# Altium schematic sheet Sheet1.SchDoc
size 689 x 565 mm
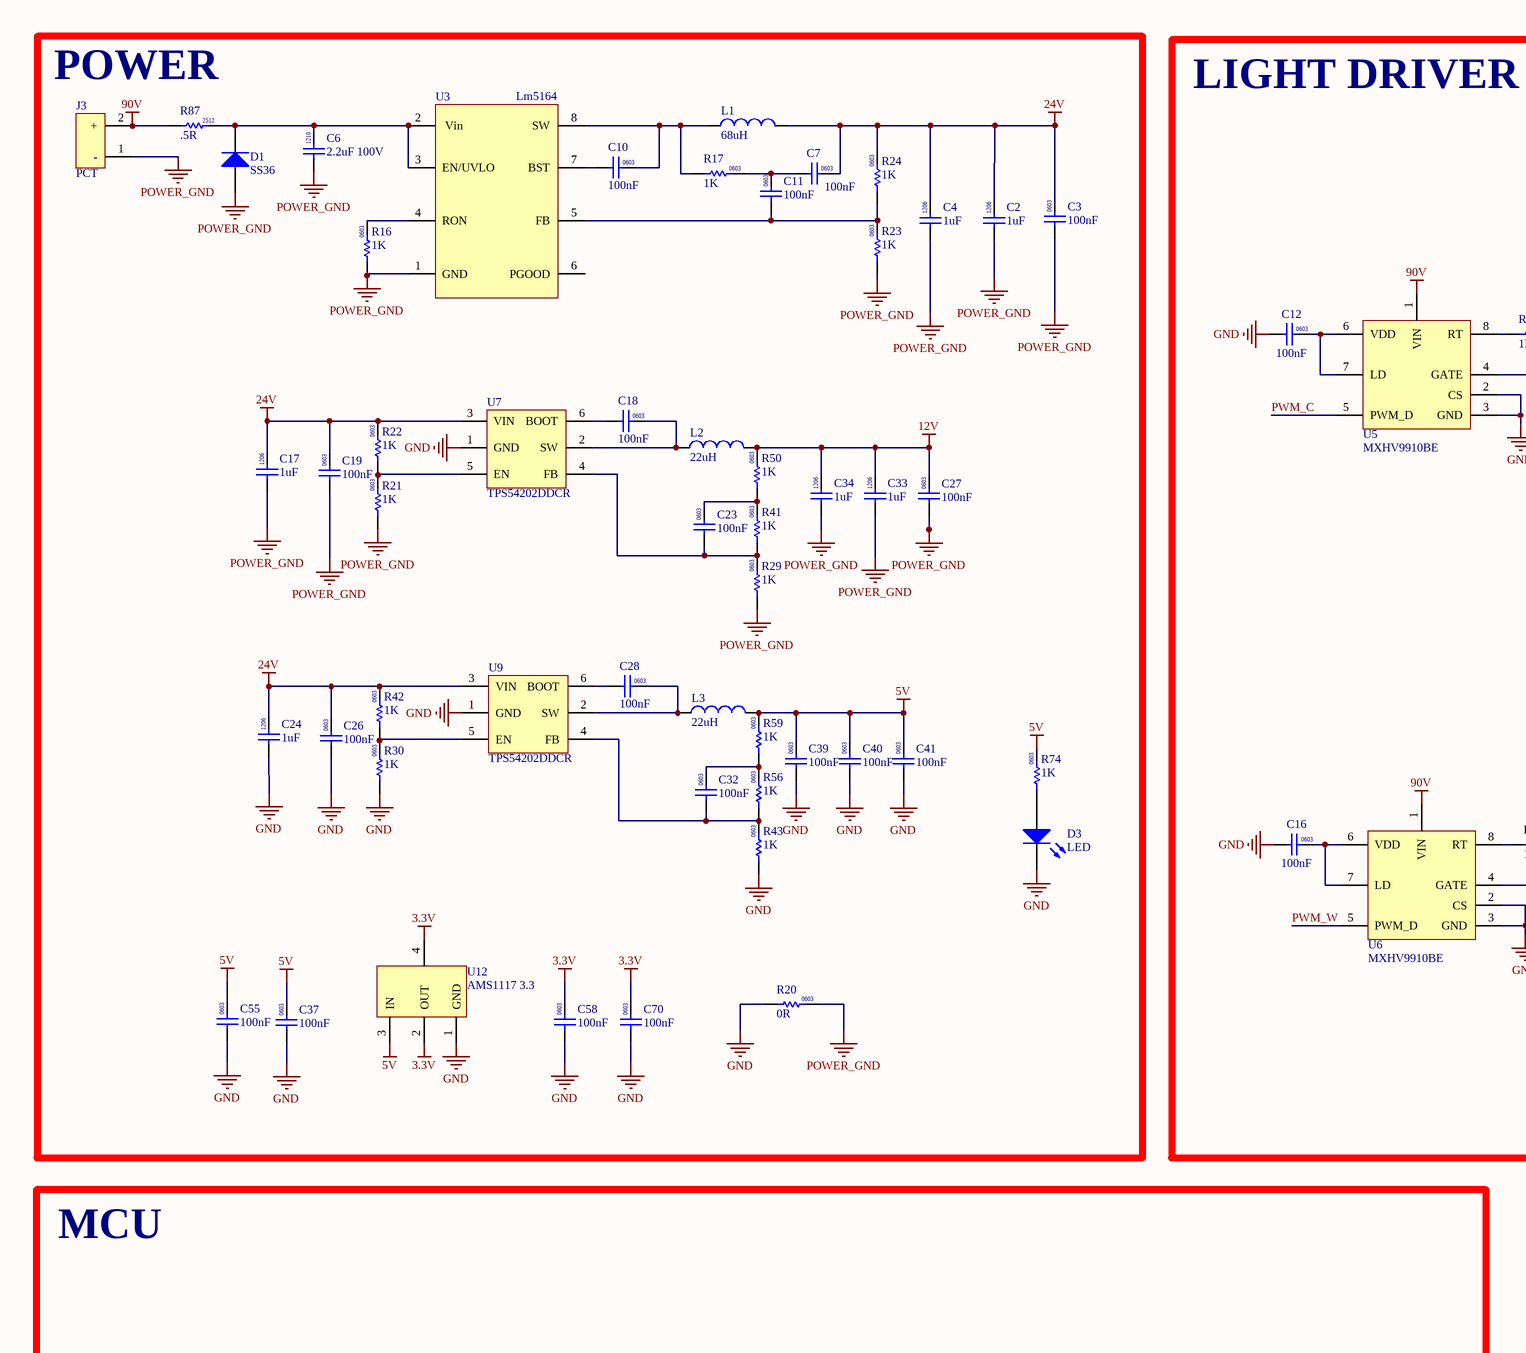
[diagram p0: Sheet1.SchDoc, top left]
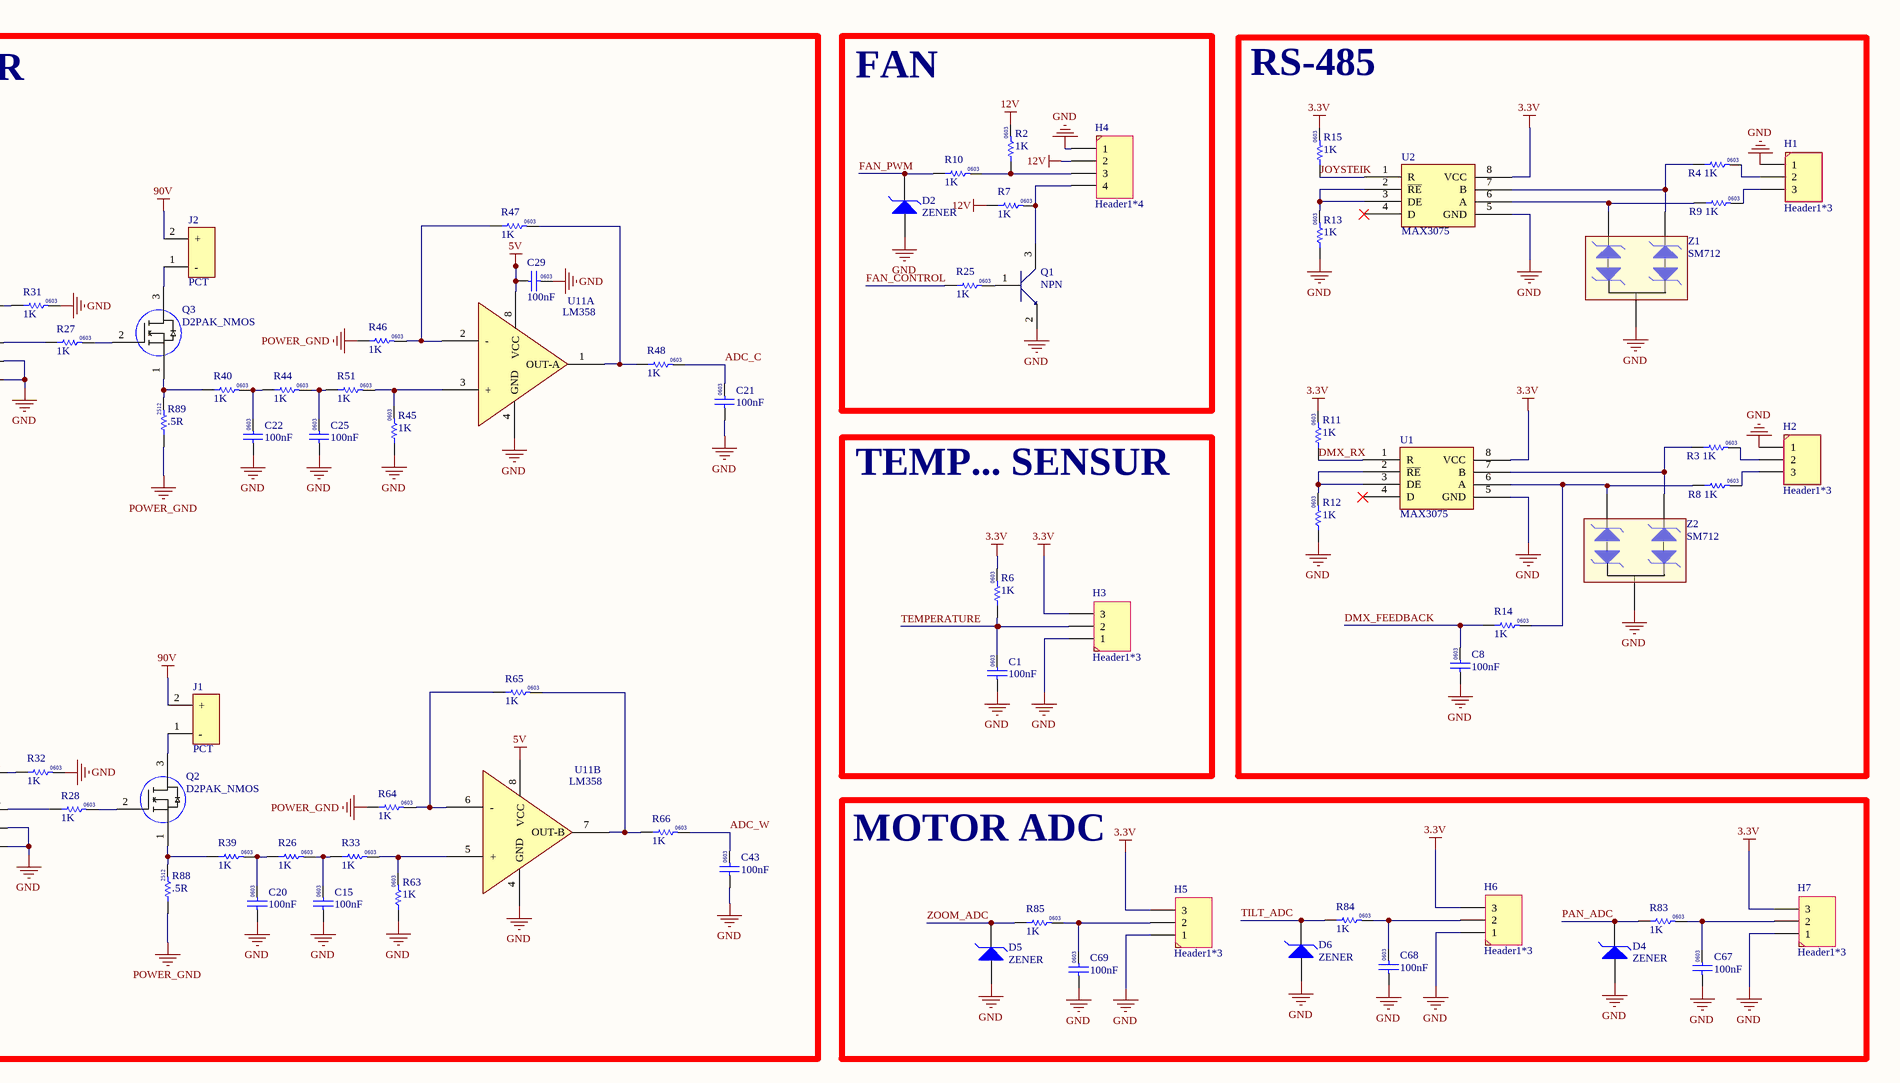
[diagram p1: Sheet1.SchDoc, top right]
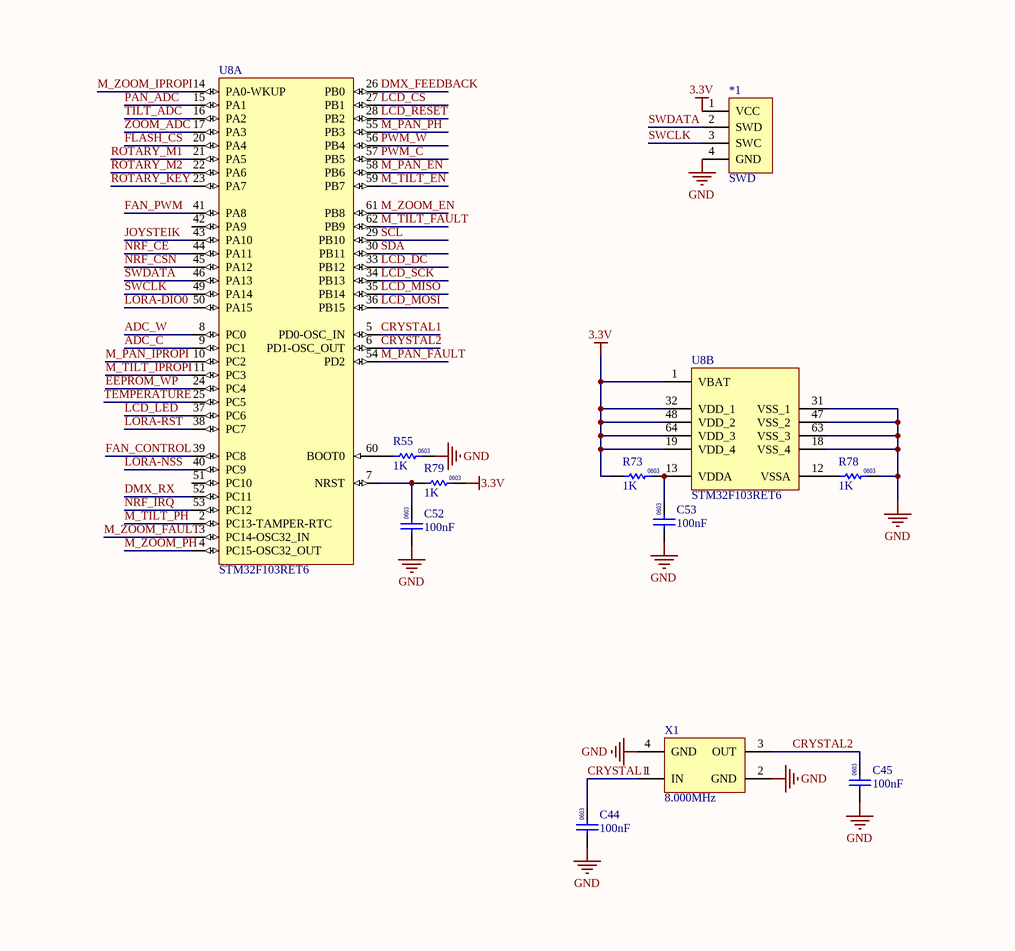
[diagram p2: Sheet1.SchDoc, bottom left]
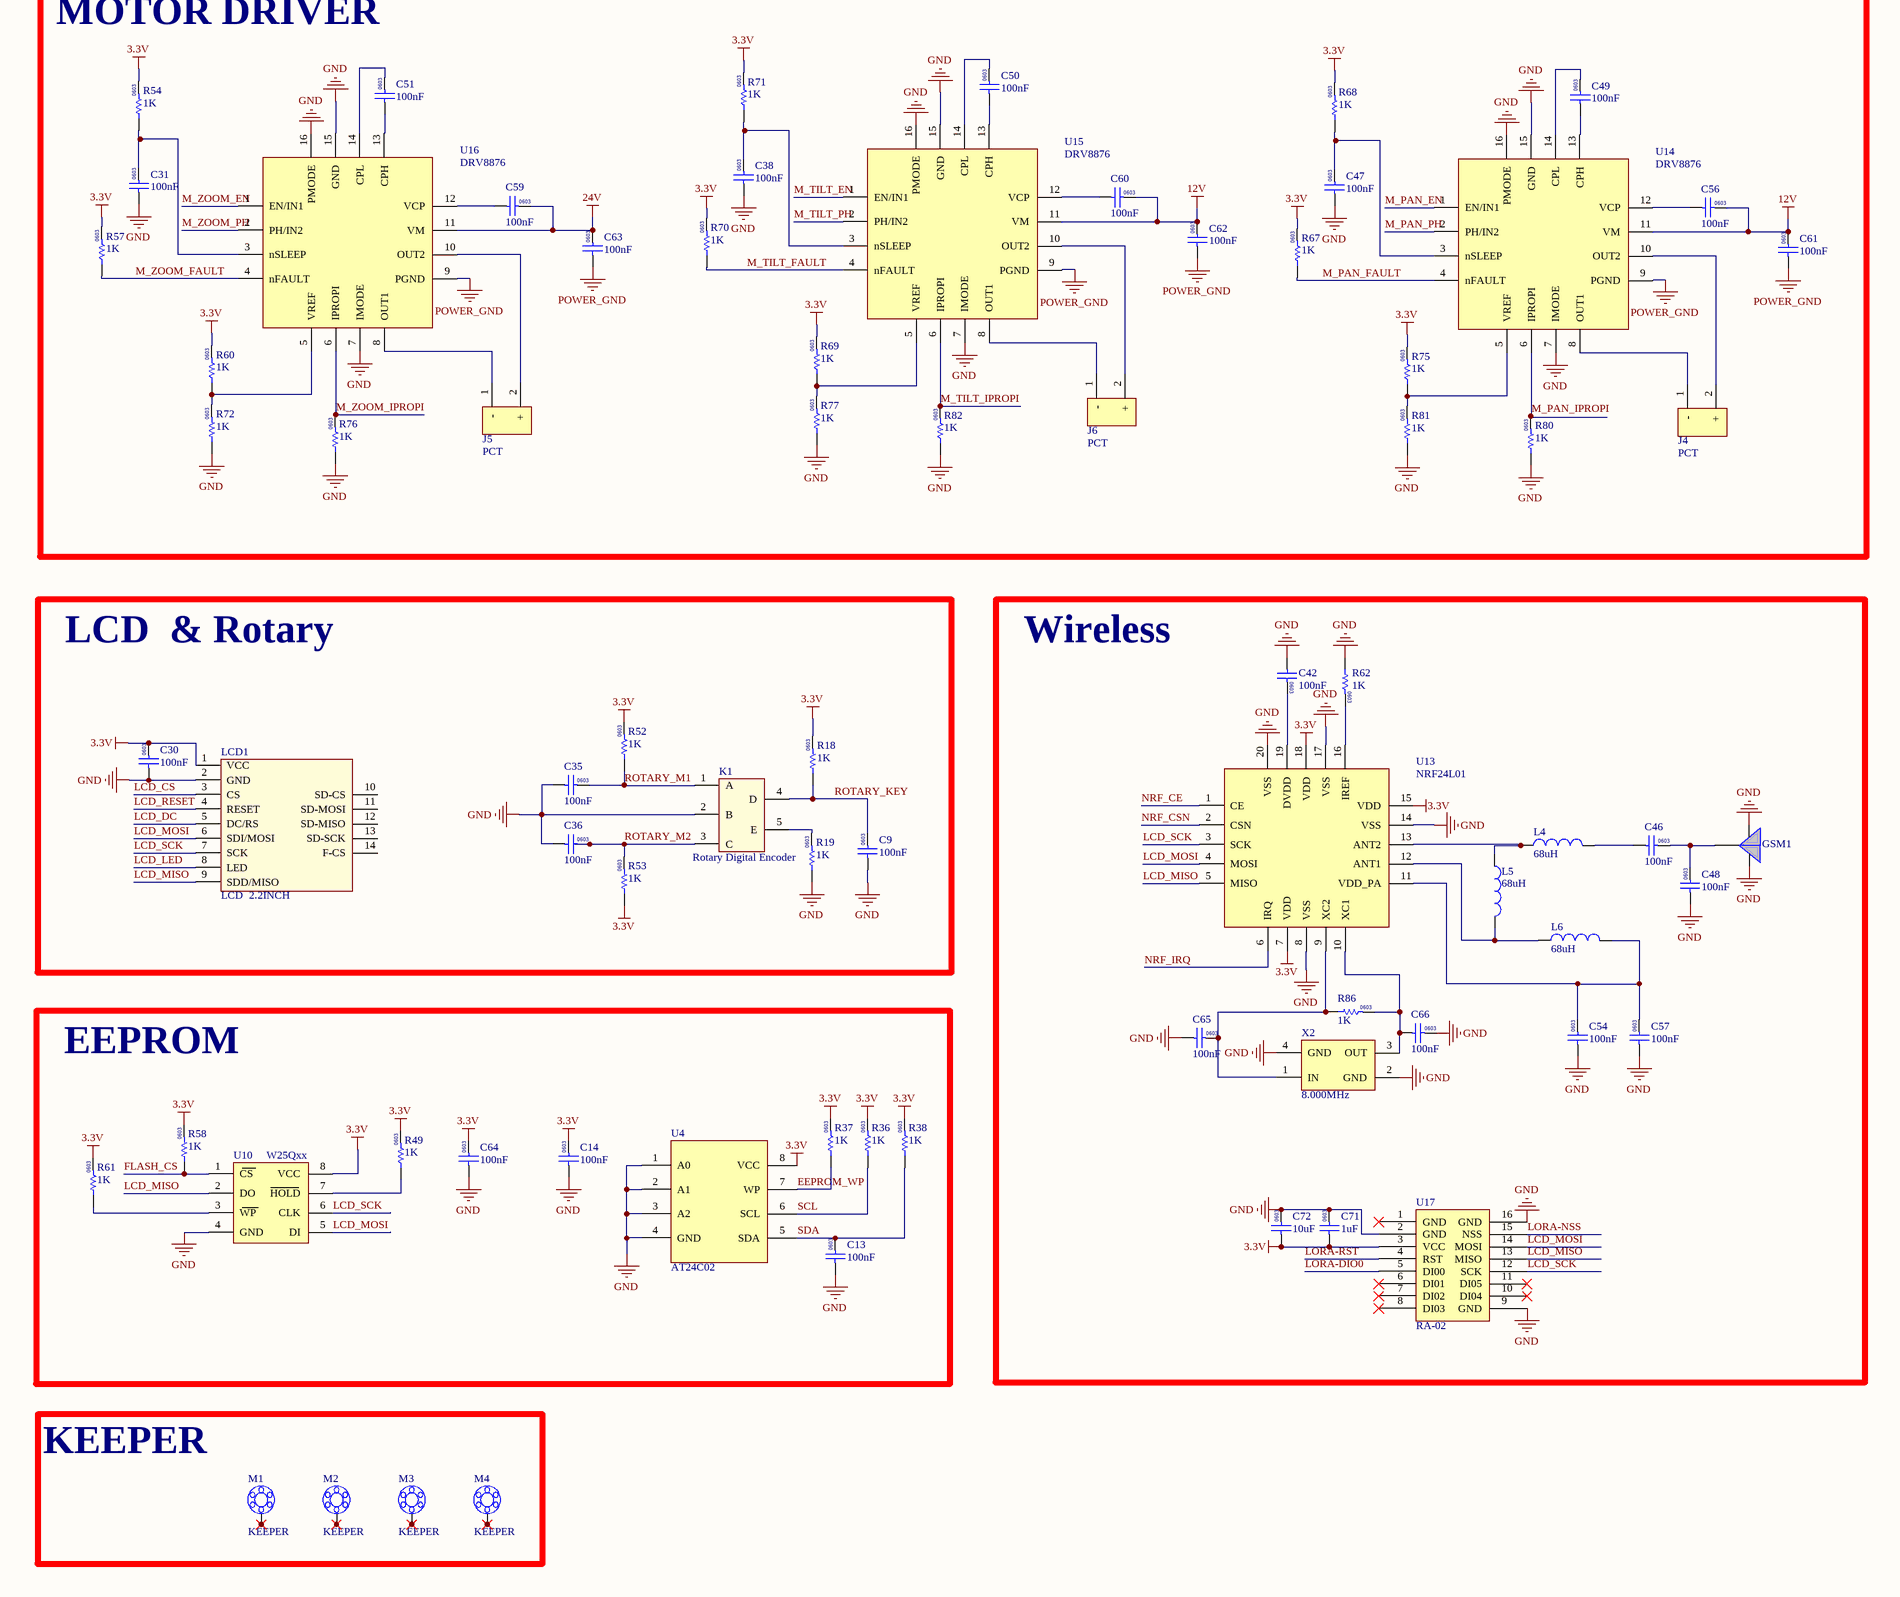
[diagram p3: Sheet1.SchDoc, bottom right]

## Parts
*1  SWD  [SWD]
C1  100nF  [CAP0603]
C2  1uF  [CAP1206]
C3  100nF  [CAP0603]
C4  1uF  [CAP1206]
C6  2.2uF 100V  [CAP 1210]
C7  100nF  [CAP0603]
C8  100nF  [CAP0603]
C9  100nF  [CAP0603]
C10  100nF  [CAP0603]
C11  100nF  [CAP0603]
C12  100nF  [CAP0603]
C13  100nF  [CAP0603]
C14  100nF  [CAP0603]
C15  100nF  [CAP0603]
C16  100nF  [CAP0603]
C17  1uF  [CAP1206]
C18  100nF  [CAP0603]
C19  100nF  [CAP0603]
C20  100nF  [CAP0603]
C21  100nF  [CAP0603]
C22  100nF  [CAP0603]
C23  100nF  [CAP0603]
C24  1uF  [CAP1206]
C25  100nF  [CAP0603]
C26  100nF  [CAP0603]
C27  100nF  [CAP0603]
C28  100nF  [CAP0603]
C29  100nF  [CAP0603]
C30  100nF  [CAP0603]
C31  100nF  [CAP0603]
C32  100nF  [CAP0603]
C33  1uF  [CAP1206]
C34  1uF  [CAP1206]
C35  100nF  [CAP0603]
C36  100nF  [CAP0603]
C37  100nF  [CAP0603]
C38  100nF  [CAP0603]
C39  100nF  [CAP0603]
C40  100nF  [CAP0603]
C41  100nF  [CAP0603]
C42  100nF  [CAP0603]
C43  100nF  [CAP0603]
C44  100nF  [CAP0603]
C45  100nF  [CAP0603]
C46  100nF  [CAP0603]
C47  100nF  [CAP0603]
C48  100nF  [CAP0603]
C49  100nF  [CAP0603]
C50  100nF  [CAP0603]
C51  100nF  [CAP0603]
C52  100nF  [CAP0603]
C53  100nF  [CAP0603]
C54  100nF  [CAP0603]
C55  100nF  [CAP0603]
C56  100nF  [CAP0603]
C57  100nF  [CAP0603]
C58  100nF  [CAP0603]
C59  100nF  [CAP0603]
C60  100nF  [CAP0603]
C61  100nF  [CAP0603]
C62  100nF  [CAP0603]
C63  100nF  [CAP0603]
C64  100nF  [CAP0603]
C65  100nF  [CAP0603]
C66  100nF  [CAP0603]
C67  100nF  [CAP0603]
C68  100nF  [CAP0603]
C69  100nF  [CAP0603]
C70  100nF  [CAP0603]
C71  1uF  [CAP0603]
C72  10uF  [CAP0603]
D1  SS36  [SS36]
D2  ZENER  [ZENER]
D3  LED  [LED0805]
D4  ZENER  [ZENER]
D5  ZENER  [ZENER]
D6  ZENER  [ZENER]
GSM1  Antenna  [IPX Connector]  (value not drawn)
H1  Header1*3  [HEADER1*3]
H2  Header1*3  [HEADER1*3]
H3  Header1*3  [HEADER1*3]
H4  Header1*4  [HEADER1*4]
H5  Header1*3  [HEADER1*3]
H6  Header1*3  [HEADER1*3]
H7  Header1*3  [HEADER1*3]
J1  PCT  [Power Connector Straght]
J2  PCT  [Power Connector Straght]
J3  PCT  [Power Connector Straght]
J4  PCT  [Power Connector Straght]
J5  PCT  [Power Connector Straght]
J6  PCT  [Power Connector Straght]
K1  Rotary Digital Encoder  [Rotary Digital Encoder]
L1  68uH  [INDUCTOR  10*10]
L2  22uH  [INDUCTOR 7*7]
L3  22uH  [INDUCTOR 7*7]
L4  68uH  [RES0603]
L5  68uH  [RES0603]
L6  68uH  [RES0603]
LCD1  LCD  2.2INCH  [TFT LCD 2.2inch  QVGA]
M1  KEEPER  [MOUNTING]
M2  KEEPER  [MOUNTING]
M3  KEEPER  [MOUNTING]
M4  KEEPER  [MOUNTING]
Q1  NPN  [BC817]
Q2  D2PAK_NMOS  [D2PAK_NMOS]
Q3  D2PAK_NMOS  [D2PAK_NMOS]
R2  1K  [RES0603]
R3  1K  [RES0603]
R4  1K  [RES0603]
R6  1K  [RES0603]
R7  1K  [RES0603]
R8  1K  [RES0603]
R9  1K  [RES0603]
R10  1K  [RES0603]
R11  1K  [RES0603]
R12  1K  [RES0603]
R13  1K  [RES0603]
R14  1K  [RES0603]
R15  1K  [RES0603]
R16  1K  [RES0603]
R17  1K  [RES0603]
R18  1K  [RES0603]
R19  1K  [RES0603]
R20  0R  [RES0603]
R21  1K  [RES0603]
R22  1K  [RES0603]
R23  1K  [RES0603]
R24  1K  [RES0603]
R25  1K  [RES0603]
R26  1K  [RES0603]
R27  1K  [RES0603]
R28  1K  [RES0603]
R29  1K  [RES0603]
R30  1K  [RES0603]
R31  1K  [RES0603]
R32  1K  [RES0603]
R33  1K  [RES0603]
R36  1K  [RES0603]
R37  1K  [RES0603]
R38  1K  [RES0603]
R39  1K  [RES0603]
R40  1K  [RES0603]
R41  1K  [RES0603]
R42  1K  [RES0603]
R43  1K  [RES0603]
R44  1K  [RES0603]
R45  1K  [RES0603]
R46  1K  [RES0603]
R47  1K  [RES0603]
R48  1K  [RES0603]
R49  1K  [RES0603]
R50  1K  [RES0603]
R51  1K  [RES0603]
R52  1K  [RES0603]
R53  1K  [RES0603]
R54  1K  [RES0603]
R55  1K  [RES0603]
R56  1K  [RES0603]
R57  1K  [RES0603]
R58  1K  [RES0603]
R59  1K  [RES0603]
R60  1K  [RES0603]
R61  1K  [RES0603]
R62  1K  [RES0603]
R63  1K  [RES0603]
R64  1K  [RES0603]
R65  1K  [RES0603]
R66  1K  [RES0603]
R67  1K  [RES0603]
R68  1K  [RES0603]
R69  1K  [RES0603]
R70  1K  [RES0603]
R71  1K  [RES0603]
R72  1K  [RES0603]
R73  1K  [RES0603]
R74  1K  [RES0603]
R75  1K  [RES0603]
R76  1K  [RES0603]
R77  1K  [RES0603]
R78  1K  [RES0603]
R79  1K  [RES0603]
R80  1K  [RES0603]
R81  1K  [RES0603]
R82  1K  [RES0603]
R83  1K  [RES0603]
R84  1K  [RES0603]
R85  1K  [RES0603]
R86  1K  [RES0603]
R87  .5R  [RES2512]
R88  .5R  [RES2512]
R89  .5R  [RES2512]
U1  MAX3075  [MAX3075]
U2  MAX3075  [MAX3075]
U3  Lm5164  [Lm5164]
U4  AT24C02  [AT24C02]
U5  MXHV9910BE  [MXHV9910BE]
U6  MXHV9910BE  [MXHV9910BE]
U7  TPS54202DDCR  [TPS54202DDCR]
U8  STM32F103RET6  [STM32F103RET6]  (parts A,B of 2)
U9  TPS54202DDCR  [TPS54202DDCR]
U10  W25Qxx  [W25QXX]
U11  LM358  [LM358]  (parts A,B of 2)
U12  AMS1117 3.3  [AMS1117]
U13  NRF24L01  [NRF24L01]
U14  DRV8876  [Drv8876]
U15  DRV8876  [Drv8876]
U16  DRV8876  [Drv8876]
U17  RA-02  [LORA]
X1  8.000MHz  [CRYSTAL_SMD4PIN]
X2  8.000MHz  [CRYSTAL - SMD4PIN 1.6*2]
Z1  SM712  [BC817]
Z2  SM712  [BC817]

## Blocks framed on the sheet
POWER: C2-C4 C6 C7 C10 C11 C17-C19 C23 C24 C26-C28 C32-C34 C37 C39-C41 C55 C58 C70 D1 D3 J3 L1-L3 R16 R17 R20-R24 R29 R30 R41-R43 R50 R56 R59 R74 R87 U3 U7 U9 U12
LIGHT DRIVER: C12 C15 C16 C20-C22 C25 C29 C43 J1 J2 Q2 Q3 R26-R28 R31-R33 R39 R40 R44-R48 R51 R63-R66 R88 R89 U5 U6 U11
FAN: D2 H4 Q1 R2 R7 R10 R25
RS-485: C8 H1 H2 R3 R4 R8 R9 R11-R15 U1 U2 Z1 Z2
TEMP... SENSUR: C1 H3 R6
MOTOR ADC: C67-C69 D4-D6 H5-H7 R83-R85
MCU: *1 C44 C45 C52 C53 R55 R73 R78 R79 U8 X1
MOTOR DRIVER: C31 C38 C47 C49-C51 C56 C59-C63 J4-J6 R54 R57 R60 R67-R72 R75-R77 R80-R82 U14-U16
LCD  & Rotary: C9 C30 C35 C36 K1 LCD1 R18 R19 R52 R53
Wireless: C42 C46 C48 C54 C57 C65 C66 C71 C72 GSM1 L4-L6 R62 R86 U13 U17 X2
EEPROM: C13 C14 C64 R36-R38 R49 R58 R61 U4 U10
KEEPER: M1-M4

## Nets
3.3V: *1.1(VCC) C14.2 C30.2 C58.2 C64.2 C70.2 C71.1 C72.1 H3.3 H5.3 H6.3 H7.3 LCD1.1(VCC) R6.2 R11.2 R15.2 R18.2 R36.2 R37.2 R38.2 R49.2 R52.2 R53.1 R54.2 R57.2 R58.2 R60.2 R61.2 R67.2 R68.2 R69.2 R70.2 R71.2 R73.1 R75.2 R79.2 U1.8(VCC) U2.8(VCC) U4.8(VCC) U8.1(VBAT) U8.19(VDD_4) U8.32(VDD_1) U8.48(VDD_2) U8.64(VDD_3) U10.8(VCC) U12.2(OUT) U12.4 U13.7(VDD) U13.15(VDD) U13.18(VDD) U17.3(VCC)
5V: C29.1 C37.2 C39.2 C40.2 C41.2 C55.2 L3.2 R59.2 R74.2 U11.8(VCC) U12.3(IN)
12V: C27.2 C33.2 C34.2 C56.2 C60.2 C61.2 C62.2 H4.2 L2.2 R2.2 R7.1 R50.2 U14.11(VM) U15.11(VM)
24V: C2.2 C3.2 C4.2 C7.2 C17.2 C19.2 C24.2 C26.2 C59.2 C63.2 L1.2 R22.2 R24.2 R42.2 U7.3(VIN) U9.3(VIN) U16.11(VM)
90V: J1.2(+) J2.2(+) J3.2(+) R87.1 U5.1(VIN) U6.1(VIN)
GND: *1.4(GND) C1.1 C8.1 C9.1 C12.1 C13.1 C14.1 C15.1 C16.1 C20.1 C21.1 C22.1 C24.1 C25.1 C26.1 C29.2 C30.1 C31.1 C35.1 C36.1 C37.1 C38.1 C39.1 C40.1 C41.1 C42.1 C43.1 C44.1 C45.1 C47.1 C48.1 C52.1 C53.1 C54.1 C55.1 C57.1 C58.1 C64.1 C65.1 C66.2 C67.1 C68.1 C69.1 C70.1 C71.2 C72.2 D2.1(A) D3.2(K) D4.1(A) D5.1(A) D6.1(A) GSM1.1 GSM1.2 H1.1 H2.1 H3.1 H4.1 H5.1 H6.1 H7.1 K1.2(B) LCD1.2(GND) Q1.2(E) R12.1 R13.1 R19.1 R20.1 R30.1 R31.2 R32.2 R43.1 R45.1 R55.2 R62.1 R63.1 R72.1 R76.1 R77.1 R78.2 R80.1 R81.1 R82.1 U1.5(GND) U2.5(GND) U4.1(A0) U4.2(A1) U4.3(A2) U4.4(GND) U5.2(CS) U5.3(GND) U6.2(CS) U6.3(GND) U7.1(GND) U8.18(VSS_4) U8.31(VSS_1) U8.47(VSS_2) U8.63(VSS_3) U9.1(GND) U10.4(GND) U11.4(GND) U12.1(GND) U13.8(VSS) U13.14(VSS) U13.17(VSS) U13.20(VSS) U14.7(IMODE) U14.15(GND) U14.16(PMODE) U15.7(IMODE) U15.15(GND) U15.16(PMODE) U16.7(IMODE) U16.15(GND) U16.16(PMODE) U17.2(GND) U17.9(GND) U17.16(GND) X1.2(GND) X1.4(GND) X2.2(GND) X2.4(GND) Z1.3(K) Z2.3(K)
POWER_GND: C2.1 C3.1 C4.1 C6.1 C17.1 C19.1 C27.1 C33.1 C34.1 C61.1 C62.1 C63.1 D1.1(A) J3.1(-) R16.1 R20.2 R21.1 R23.1 R29.1 R46.1 R64.1 R88.1 R89.1 U3.1(GND) U14.9(PGND) U15.9(PGND) U16.9(PGND)
ADC_C: C21.2 R48.2 U8.9(PC1)
ADC_W: C43.2 R66.2 U8.8(PC0)
CRYSTAL1: C44.2 U8.5(PD0-OSC_IN) X1.1(IN)
CRYSTAL2: C45.2 U8.6(PD1-OSC_OUT) X1.3(OUT)
DMX_FEEDBACK: C8.2 R14.1 U8.26(PB0)
DMX_RX: R11.1 U1.1(R) U8.52(PC11)
EEPROM_WP: R37.1 U4.7(WP) U8.24(PC4)
FAN_CONTROL: R25.1 U8.39(PC8)
FAN_PWM: D2.2(K) R10.1 U8.41(PA8)
FLASH_CS: R58.1 U8.20(PA4) U10.1(CS)
JOYSTEIK: R15.1 U2.1(R) U8.43(PA10)
LCD_CS: LCD1.3(CS) U8.27(PB1)
LCD_DC: LCD1.5(DC/RS) U8.33(PB12)
LCD_LED: LCD1.8(LED) U8.37(PC6)
LCD_MISO: LCD1.9(SDD/MISO) U8.35(PB14) U10.2(DO) U13.5(MISO) U17.13(MISO)
LCD_MOSI: LCD1.6(SDI/MOSI) U8.36(PB15) U10.5(DI) U13.4(MOSI) U17.14(MOSI)
LCD_RESET: LCD1.4(RESET) U8.28(PB2)
LCD_SCK: LCD1.7(SCK) U8.34(PB13) U10.6(CLK) U13.3(SCK) U17.12(SCK)
LORA-DIO0: U8.50(PA15) U17.5(DI00)
LORA-NSS: U8.40(PC9) U17.15(NSS)
LORA-RST: U8.38(PC7) U17.4(RST)
M_PAN_EN: U8.58(PB6) U14.1(EN/IN1)
M_PAN_FAULT: R67.1 U8.54(PD2) U14.4(nFAULT)
M_PAN_IPROPI: R80.2 U8.10(PC2) U14.6(IPROPI)
M_PAN_PH: U8.55(PB3) U14.2(PH/IN2)
M_TILT_EN: U8.59(PB7) U15.1(EN/IN1)
M_TILT_FAULT: R70.1 U8.62(PB9) U15.4(nFAULT)
M_TILT_IPROPI: R82.2 U8.11(PC3) U15.6(IPROPI)
M_TILT_PH: U8.2(PC13-TAMPER-RTC) U15.2(PH/IN2)
M_ZOOM_EN: U8.61(PB8) U16.1(EN/IN1)
M_ZOOM_FAULT: R57.1 U8.3(PC14-OSC32_IN) U16.4(nFAULT)
M_ZOOM_IPROPI: R76.2 U8.14(PA0-WKUP) U16.6(IPROPI)
M_ZOOM_PH: U8.4(PC15-OSC32_OUT) U16.2(PH/IN2)
NRF_CE: U8.44(PA11) U13.1(CE)
NRF_CSN: U8.45(PA12) U13.2(CSN)
NRF_IRQ: U8.53(PC12) U13.6(IRQ)
PAN_ADC: D4.2(K) R83.1 U8.15(PA1)
PWM_C: U5.5(PWM_D) U8.57(PB5)
PWM_W: U6.5(PWM_D) U8.56(PB4)
ROTARY_KEY: C9.2 K1.4(D) R18.1 U8.23(PA7)
ROTARY_M1: C35.2 K1.1(A) R52.1 U8.21(PA5)
ROTARY_M2: C36.2 K1.3(C) R53.2 U8.22(PA6)
SCL: R36.1 U4.6(SCL) U8.29(PB10)
SDA: C13.2 R38.1 U4.5(SDA) U8.30(PB11)
SWCLK: *1.3(SWC) U8.49(PA14)
SWDATA: *1.2(SWD) U8.46(PA13)
TEMPERATURE: C1.2 H3.2 R6.1 U8.25(PC5)
TILT_ADC: D6.2(K) R84.1 U8.16(PA2)
ZOOM_ADC: D5.2(K) R85.1 U8.17(PA3)
NetC6_2: C6.2 D1.2(K) R87.2 U3.2(Vin) U3.3(EN/UVLO)
NetC7_1: C7.1 C11.2 R17.2
NetC10_1: C10.1 U3.7(BST)
NetC10_2: C10.2 L1.1 R17.1 U3.8(SW)
NetC11_1: C11.1 R23.2 R24.1 U3.5(FB)
NetC12_2: C12.2 U5.6(VDD) U5.7(LD)
NetC15_2: C15.2 R26.2 R33.1
NetC16_2: C16.2 U6.6(VDD) U6.7(LD)
NetC18_1: C18.1 U7.6(BOOT)
NetC18_2: C18.2 L2.1 U7.2(SW)
NetC20_2: C20.2 R26.1 R39.2
NetC22_2: C22.2 R40.2 R44.1
NetC23_1: C23.1 R29.2 R41.1 U7.4(FB)
NetC23_2: C23.2 R41.2 R50.1
NetC25_2: C25.2 R44.2 R51.1
NetC28_1: C28.1 U9.6(BOOT)
NetC28_2: C28.2 L3.1 U9.2(SW)
NetC31_2: C31.2 R54.1 U16.3(nSLEEP)
NetC32_1: C32.1 R43.2 R56.1 U9.4(FB)
NetC32_2: C32.2 R56.2 R59.1
NetC38_2: C38.2 R71.1 U15.3(nSLEEP)
NetC42_2: C42.2 U13.19(DVDD)
NetC46_1: C46.1 L4.2
NetC46_2: C46.2 C48.2 GSM1.3
NetC47_2: C47.2 R68.1 U14.3(nSLEEP)
NetC49_1: C49.1 U14.13(CPH)
NetC49_2: C49.2 U14.14(CPL)
NetC50_1: C50.1 U15.13(CPH)
NetC50_2: C50.2 U15.14(CPL)
NetC51_1: C51.1 U16.13(CPH)
NetC51_2: C51.2 U16.14(CPL)
NetC52_2: C52.2 R79.1 U8.7(NRST)
NetC53_2: C53.2 R73.2 U8.13(VDDA)
NetC54_2: C54.2 C57.2 L6.2 U13.11(VDD_PA)
NetC56_1: C56.1 U14.12(VCP)
NetC59_1: C59.1 U16.12(VCP)
NetC60_1: C60.1 U15.12(VCP)
NetC65_2: C65.2 R86.1 U13.9(XC2) X2.1(IN)
NetC66_1: C66.1 R86.2 U13.10(XC1) X2.3(OUT)
NetC67_2: C67.2 H7.2 R83.2
NetC68_2: C68.2 H6.2 R84.2
NetC69_2: C69.2 H5.2 R85.2
NetD3_1: D3.1(A) R74.1
NetH1_2: H1.2 R4.2
NetH1_3: H1.3 R9.2
NetH2_2: H2.2 R3.2
NetH2_3: H2.3 R8.2
NetH4_3: H4.3 R2.1 R10.2
NetH4_4: H4.4 Q1.3(C) R7.2
NetJ1_1: J1.1(-) Q2.3(D)
NetJ2_1: J2.1(-) Q3.3(D)
NetJ4_1: J4.1(-) U14.8(OUT1)
NetJ4_2: J4.2(+) U14.10(OUT2)
NetJ5_1: J5.1(-) U16.8(OUT1)
NetJ5_2: J5.2(+) U16.10(OUT2)
NetJ6_1: J6.1(-) U15.8(OUT1)
NetJ6_2: J6.2(+) U15.10(OUT2)
NetK1_5: K1.5(E) R19.2
NetL4_1: L4.1 L5.1 U13.13(ANT2)
NetL5_2: L5.2 L6.1 U13.12(ANT1)
NetM1_1: M1.1 M1.2 M1.3 M1.4 M1.5 M1.6 M1.7
NetM2_1: M2.1 M2.2 M2.3 M2.4 M2.5 M2.6 M2.7
NetM3_1: M3.1 M3.2 M3.3 M3.4 M3.5 M3.6 M3.7
NetM4_1: M4.1 M4.2 M4.3 M4.4 M4.5 M4.6 M4.7
NetQ1_1: Q1.1(B) R25.2
NetQ2_1: Q2.1 R39.1 R88.2
NetQ2_2: Q2.2 R28.2
NetQ3_1: Q3.1 R40.1 R89.2
NetQ3_2: Q3.2 R27.2
NetR3_1: R3.1 U1.7(B) Z2.2(K)
NetR4_1: R4.1 U2.7(B) Z1.2(K)
NetR8_1: R8.1 R14.2 U1.6(A) Z2.1(K)
NetR9_1: R9.1 U2.6(A) Z1.1(K)
NetR12_2: R12.2 U1.2(~{RE}) U1.3(DE)
NetR13_2: R13.2 U2.2(~{RE}) U2.3(DE)
NetR16_2: R16.2 U3.4(RON)
NetR21_2: R21.2 R22.1 U7.5(EN)
NetR27_1: R27.1 U5.4(GATE)
NetR28_1: R28.1 U6.4(GATE)
NetR30_2: R30.2 R42.1 U9.5(EN)
NetR31_1: R31.1 U5.8(RT)
NetR32_1: R32.1 U6.8(RT)
NetR33_2: R33.2 R63.2 U11.5(+)
NetR45_2: R45.2 R51.2 U11.3(+)
NetR46_2: R46.2 R47.1 U11.2(-)
NetR47_2: R47.2 R48.1 U11.1(OUT-A)
NetR49_1: R49.1 U10.7(HOLD)
NetR55_1: R55.1 U8.60(BOOT0)
NetR60_1: R60.1 R72.2 U16.5(VREF)
NetR61_1: R61.1 U10.3(WP)
NetR62_2: R62.2 U13.16(IREF)
NetR64_2: R64.2 R65.1 U11.6(-)
NetR65_2: R65.2 R66.1 U11.7(OUT-B)
NetR69_1: R69.1 R77.2 U15.5(VREF)
NetR75_1: R75.1 R81.2 U14.5(VREF)
NetR78_1: R78.1 U8.12(VSSA)

Not connected (* = marked no-connect by the designer): LCD1 10(SD-CS) 11(SD-MOSI) 12(SD-MISO) 13(SD-SCK) 14(F-CS); U1 4(D)*; U2 4(D)*; U3 6(PGOOD); U8 42(PA9) 51(PC10); U17 1(GND)* 6(DI01)* 7(DI02)* 8(DI03)* 10(DI04)* 11(DI05)*

## Notes on the sheet
- (in symbol CAP0603) 0603
- (in symbol CAP1206) 1206
- (in symbol CAP1210) 1210
- (in symbol RES0603) 0603
- (in symbol RES2512) 2512

## Library data of the parts
C1 C3 C7-C16 C18-C23 C25-C32 C35-C72 = CAP0603
C2 C4 C17 C24 C33 C34 = CAP1206
C6 = CAP1210
D3 = LED0805
H1-H3 H5-H7 = Header1*3: Header, 3-Pin; LatestRevisionDate: 17-Jul-2002; LatestRevisionNote: Re-released for DXP Platform.; Publisher: Altium Limited
H4 = Header1*4: Header, 4-Pin
J1-J6 = Power Connector Straght
L1 L4-L6 = INDUCTOR  10*10
L2 L3 = INDUCTOR 7*7
LCD1 = TFT LCD 2.2inch  QVGA
M1-M4 = MOUNTING
Q1 = BC817
R2-R4 R6-R33 R36-R86 = RES0603
R87-R89 = RES2512
U8 = STM32F103RET6: ARM Cortex-M3 32-bit MCU, 512 KB Flash, 64 KB Internal RAM, 51 I/Os, 64-pin LQFP, -40 to 85 degC, Tray; A/D Converter: 3x12-bit (16 Channel); D/A Converter: 2x12-bit (2 Channel); FLASH Size (Prog) (kB): 512; I/Os (High Current): 51; Internal RAM Size (kB): 64; Operating Frequency(F) (Processor speed) (MHz): 72; Supply Voltage(Vcc) min (V): 2; DatasheetVersion: Rev. 8; PackageVersion: Rev. 4, 06/2013; PackageReference: LQFP64; PackageDescription: 64-Pin Low Profile Quad Flat Package, 10 x 10 mm Body, 0.5 mm Pitch; Supplier 1: Digi-Key; Supplier Part Number 1: 497-6444-ND; Supplier 2: Farnell; Supplier Part Number 2: 1624138; Supplier 3: Newark; Supplier Part Number 3: 01P4101; Supplier 4: Newark; Supplier Part Number 4: 57P1231; Supplier 5: Mouser; Supplier Part Number 5: 511-STM32F103RET6; Core: ARM Cortex-M3; Packing: Tray; Mounting Technology: Surface Mount; PartNumber: STM32F103RET6; ComponentLink1Description: Manufacturer URL; ComponentLink1URL: http://www.st.com/web/en/home.html; ComponentLink2Description: Datasheet; ComponentLink2URL: http://www.st.com/st-web-ui/static/active/en/resource/technical/document/datasheet/CD00191185.pdf; ComponentLink3Description: Package Specification; ComponentLink3URL: http://www.st.com/st-web-ui/static/active/en/resource/technical/document/datasheet/DM00037051.pdf
U11 = LM358: Single Supply Dual Operational Amplifier
U12 = AMS1117
U17 = LORA
X1 X2 = CRYSTAL_SMD4PIN